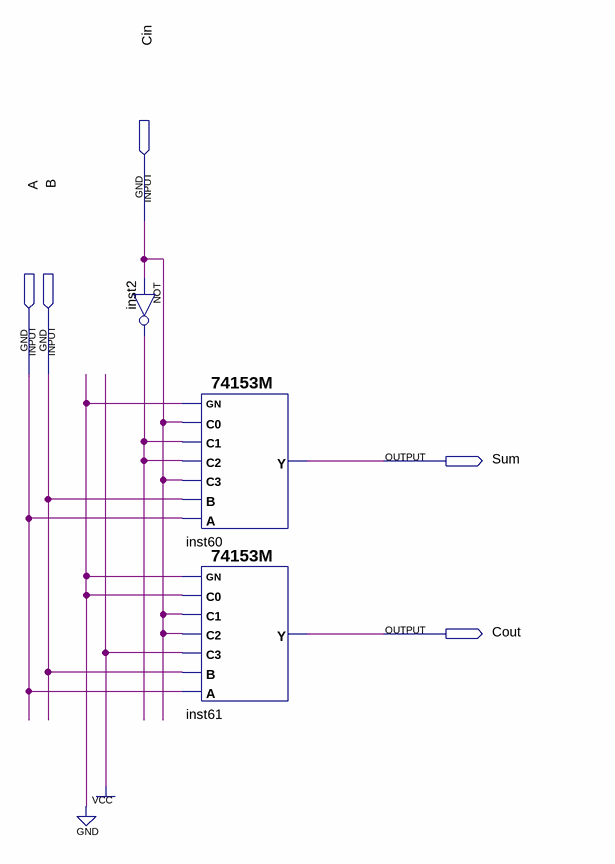
[diagram p0: schematic sheet]
// Quartus schematic 1Bit_Adder.bdf as structural Verilog: 3 symbols, 5 pins
module \1Bit_Adder  (
  input  Cin,
  input  A,
  input  B,
  output Sum,
  output Cout
);

  wire inst2_out;

  not inst2 (inst2_out, Cin);
  \74153M  inst60 (.A(A), .B(B), .C3(Cin), .C2(inst2_out), .C1(inst2_out), .C0(Cin), .GN(1'b0), .Y(Sum));
  \74153M  inst61 (.A(A), .B(B), .C3(1'b1), .C2(Cin), .C1(Cin), .C0(1'b0), .GN(1'b0), .Y(Cout));
endmodule
